# Altium project Arduino Uno R3.PrjPcb (part 1 of 3)
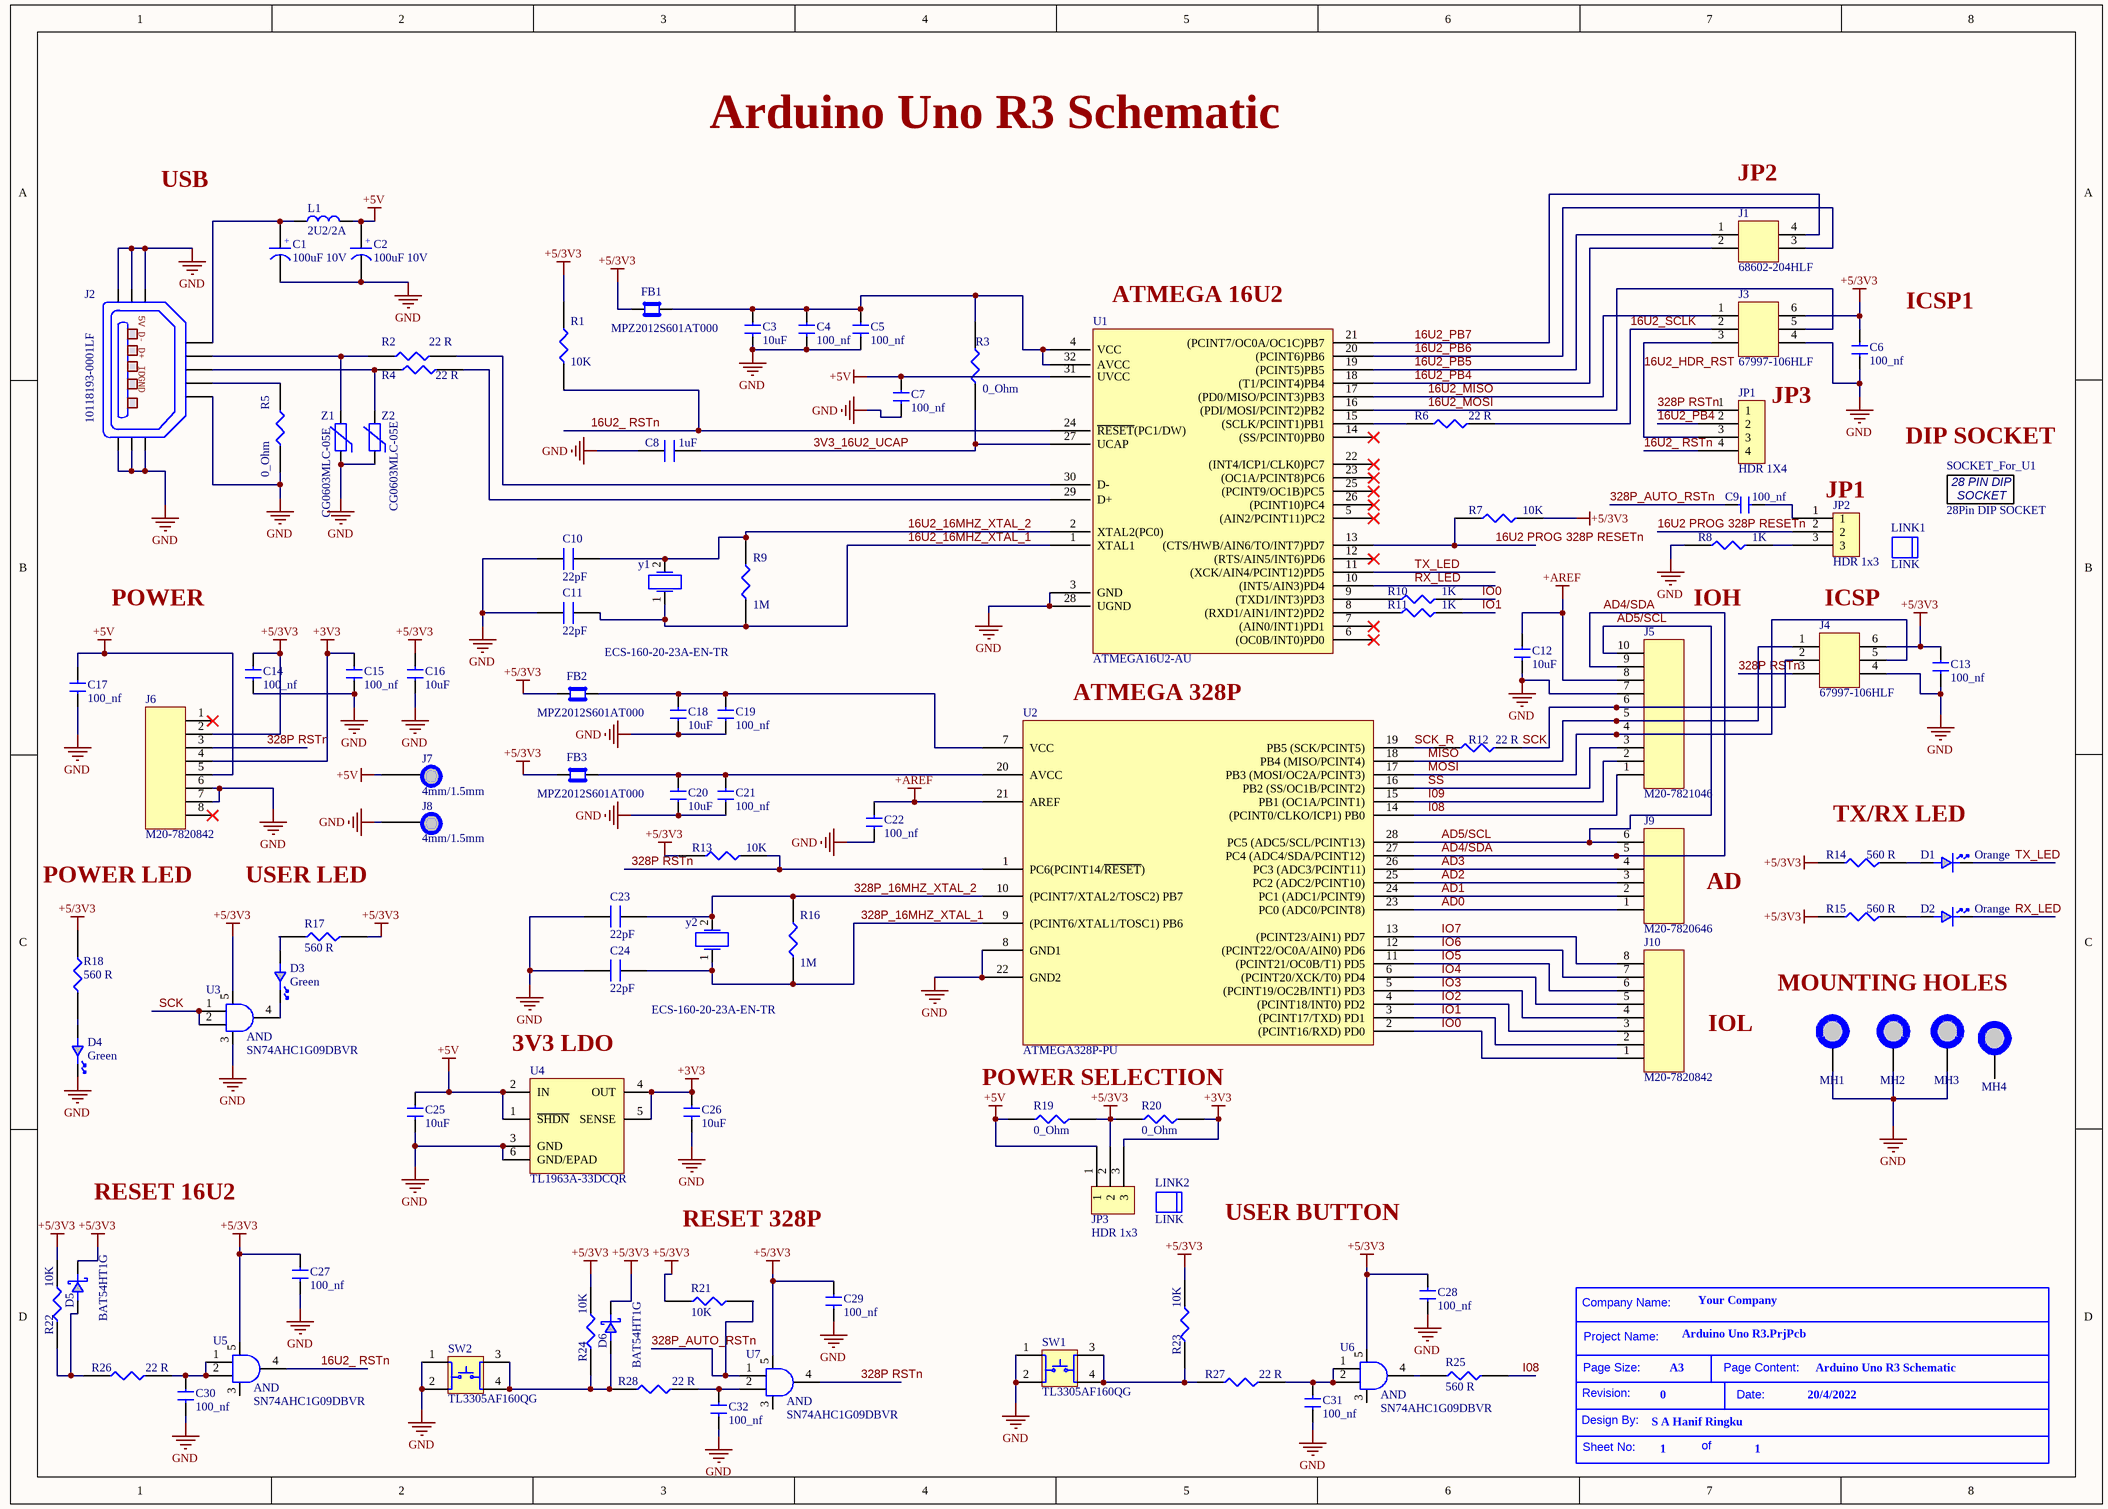
[diagram p0: Schematic Sheet Arduino .SchDoc]
1 sheet, 104 parts. Net scope: global (net labels, ports and power ports of the same name join across sheets).
Board file: PCB Arduino.PcbDoc

## Sheet Schematic Sheet Arduino .SchDoc
size A3; Date: 20/4/2022; CompanyName: Your Company; Engineer: S A Hanif Ringku; Revision: 0; SheetNumber: 1; SheetTotal: 1

### Parts
*  Title_Block  (value not drawn)  (mechanical)
C1  100uF 10V  [Cap_Alu_C_Size]
C2  100uF 10V  [Cap_Alu_C_Size]
C3  10uF  [CAP_0805]
C4  100_nf  [CAP_0805]
C5  100_nf  [CAP_0805]
C6  100_nf  [CAP_0805]
C7  100_nf  [CAP_0805]
C8  1uF  [CAP_0805]
C9  100_nf  [CAP_0805]
C10  22pF  [CAP_0805]
C11  22pF  [CAP_0805]
C12  10uF  [CAP_0805]
C13  100_nf  [CAP_0805]
C14  100_nf  [CAP_0805]
C15  100_nf  [CAP_0805]
C16  10uF  [CAP_0805]
C17  100_nf  [CAP_0805]
C18  10uF  [CAP_0805]
C19  100_nf  [CAP_0805]
C20  10uF  [CAP_0805]
C21  100_nf  [CAP_0805]
C22  100_nf  [CAP_0805]
C23  22pF  [CAP_0805]
C24  22pF  [CAP_0805]
C25  10uF  [CAP_0805]
C26  10uF  [CAP_0805]
C27  100_nf  [CAP_0805]
C28  100_nf  [CAP_0805]
C29  100_nf  [CAP_0805]
C30  100_nf  [CAP_0805]
C31  100_nf  [CAP_0805]
C32  100_nf  [CAP_0805]
D1  Orange  [LED 0603]
D2  Orange  [LED 0603]
D3  Green  [LED 0603]
D4  Green  [LED 0603]
D5  BAT54HT1G  [SOD323]
D6  BAT54HT1G  [SOD323]
FB1  MPZ2012S601AT000  [CAP_0805]
FB2  MPZ2012S601AT000  [CAP_0805]
FB3  MPZ2012S601AT000  [CAP_0805]
J1  68602-204HLF  [Male_HDR_2X2_2.54]
J2  10118193-0001LF  [USB]
J3  67997-106HLF  [MALE_HDR_3X2_2.54mm]
J4  67997-106HLF  [MALE_HDR_3X2_2.54mm]
J5  M20-7821046  [Female_HDR_10\X1_2.54mm_Pitch]
J6  M20-7820842  [Female_HDR_8\X1_2.54mm_Pitch]
J7  4mm/1.5mm  [PAD_WITH_HOLE_4MM/1.5MM]  (no BOM)
J8  4mm/1.5mm  [PAD_WITH_HOLE_4MM/1.5MM]  (no BOM)
J9  M20-7820646  [Female_HDR_6X1_2.54mm_Pitch]
J10  M20-7820842  [Female_HDR_8\X1_2.54mm_Pitch]
JP1  HDR 1X4  [HDR 1X4]
JP2  HDR 1x3  [HDR 1x3]
JP3  HDR 1x3  [HDR 1x3]
L1  2U2/2A  [C1210_Inductor]
LINK1  LINK  (mechanical)
LINK2  LINK  (mechanical)
MH1  MH_7.4_MHC_3.2  [MH_7.4 and 3.2 mm]  (value not drawn)  (no BOM)
MH2  MH_7.4_MHC_3.2  [MH_7.4 and 3.2 mm]  (value not drawn)  (no BOM)
MH3  MH_7.4_MHC_3.2  [MH_7.4 and 3.2 mm]  (value not drawn)  (no BOM)
MH4  Mountain Hole Non Plated  [MH_non_plated]  (value not drawn)  (no BOM)
R1  10K  [R_0805]
R2  22 R  [R_0805]
R3  0_Ohm  [R_0805]
R4  22 R  [R_0805]
R5  0_Ohm  [R_0805]
R6  22 R  [R_0805]
R7  10K  [R_0805]
R8  1K  [R_0805]
R9  1M  [R_0805]
R10  1K  [R_0805]
R11  1K  [R_0805]
R12  22 R  [R_0805]
R13  10K  [R_0805]
R14  560 R  [R_0805]
R15  560 R  [R_0805]
R16  1M  [R_0805]
R17  560 R  [R_0805]
R18  560 R  [R_0805]
R19  0_Ohm  [R_0805]
R20  0_Ohm  [R_0805]
R21  10K  [R_0805]
R22  10K  [R_0805]
R23  10K  [R_0805]
R24  10K  [R_0805]
R25  560 R  [R_0805]
R26  22 R  [R_0805]
R27  22 R  [R_0805]
R28  22 R  [R_0805]
SOCKET_For_U1  28Pin DIP SOCKET  [28 DIP_7.62mm_SOCKET]
SW1  TL3305AF160QG  [SW_PB_SMD]
SW2  TL3305AF160QG  [SW_PB_SMD]
U1  ATMEGA16U2-AU  [TQFP32]
U2  ATMEGA328P-PU  [Atmega_328P]
U3  SN74AHC1G09DBVR  [DBV SOT 23_5]
U4  TL1963A-33DCQR  [DCQR_PDSO_G6]
U5  SN74AHC1G09DBVR  [DBV SOT 23_5]
U6  SN74AHC1G09DBVR  [DBV SOT 23_5]
U7  SN74AHC1G09DBVR  [DBV SOT 23_5]
y1  ECS-160-20-23A-EN-TR  [Xtal_16MHZ]
y2  ECS-160-20-23A-EN-TR  [Xtal_16MHZ]
Z1  CG0603MLC-05E  [R0603]
Z2  CG0603MLC-05E  [R0603]

### Nets
+3V3: C15.2 C26.1 J6.4 JP3.3 R20.2 U4.4(OUT) U4.5(SENSE)
+5/3V3: C6.2 C13.2 C14.2 C16.1 C27.2 C28.2 C29.2 D5.1(Cathode) D6.1(Cathode) FB1.1 FB2.1 FB3.1 J3.6 J4.6 J6.2 JP3.2 R1.2 R7.2 R13.1 R14.1 R15.1 R17.2 R18.2 R19.2 R20.1 R21.1 R22.2 R23.2 R24.2 U3.5 U5.5 U6.5 U7.5
+5V: C2.1 C7.1 C17.2 C25.1 J6.5 J7.1 JP3.1 L1.2 R19.1 U1.31(UVCC) U4.1(~{SHDN}) U4.2(IN)
+AREF: C12.1 C22.2 J5.8 U2.21(AREF)
GND: C1.2 C2.2 C3.2 C4.1 C5.2 C6.1 C7.2 C8.1 C10.1 C11.1 C12.2 C13.1 C14.1 C15.1 C16.2 C17.1 C18.2 C19.1 C20.2 C21.1 C22.1 C23.1 C24.1 C25.2 C26.2 C27.1 C28.1 C29.1 C30.1 C31.1 C32.1 D4.1(Cathode) J2.5 J2.6 J2.7 J2.8 J2.9 J2.10 J2.11 J3.4 J4.4 J5.7 J6.6 J6.7 J8.1 MH1.1 MH2.1 MH3.1 R5.1 R8.1 SW1.1 SW1.2 SW2.1 SW2.2 U1.3(GND) U1.28(UGND) U2.8(GND1) U2.22(GND2) U3.3 U4.3(GND) U4.6(GND/EPAD) Z1.2 Z2.2
3V3_16U2_UCAP: C8.2 R3.1 U1.27(UCAP)
16U2 PROG 328P RESETn: JP2.2 R7.1 U1.13((CTS/HWB/AIN6/TO/INT7)PD7)
16U2_16MHZ_XTAL_1: C11.2 R9.1 U1.1(XTAL1) y1.1
16U2_16MHZ_XTAL_2: C10.2 R9.2 U1.2(XTAL2(PC0)) y1.2
16U2_ RSTn: JP1.4 R1.1 U1.24(~{RESET}(PC1/DW)) U5.4
16U2_HDR_RST: J3.3 JP1.3
16U2_MISO: J3.1 U1.17((PD0/MISO/PCINT3)PB3)
16U2_MOSI: J3.5 U1.16((PDI/MOSI/PCINT2)PB2)
16U2_PB4: J1.2 JP1.2 U1.18((T1/PCINT4)PB4)
16U2_PB5: J1.1 U1.19((PCINT5)PB5)
16U2_PB6: J1.3 U1.20((PCINT6)PB6)
16U2_PB7: J1.4 U1.21((PCINT7/OC0A/OC1C)PB7)
16U2_SCLK: J3.2 R6.2
328P RSTn: J4.3 J6.3 JP1.1 R13.2 U2.1(PC6(PCINT14/~{RESET})) U7.4
328P_16MHZ_XTAL_1: C24.2 R16.1 U2.9((PCINT6/XTAL1/TOSC1)_PB6) y2.1
328P_16MHZ_XTAL_2: C23.2 R16.2 U2.10((PCINT7/XTAL2/TOSC2)_PB7) y2.2
328P_AUTO_RSTn: C9.1 R21.2 U7.1
AD0: J9.1 U2.23(PC0_(ADC0/PCINT8))
AD1: J9.2 U2.24(PC1_(ADC1/PCINT9))
AD2: J9.3 U2.25(PC2_(ADC2/PCINT10))
AD3: J9.4 U2.26(PC3_(ADC3/PCINT11))
AD4/SDA: J5.9 J9.5 U2.27(PC4_(ADC4/SDA/PCINT12))
AD5/SCL: J5.10 J9.6 U2.28(PC5_(ADC5/SCL/PCINT13))
I08: J5.1 R25.2 U2.14((PCINT0/CLKO/ICP1)_PB0)
I09: J5.2 U2.15(PB1_(OC1A/PCINT1))
IO0: J10.1 R10.2 U2.2((PCINT16/RXD)_PD0)
IO1: J10.2 R11.2 U2.3((PCINT17/TXD)_PD1)
IO2: J10.3 U2.4((PCINT18/INT0)_PD2)
IO3: J10.4 U2.5((PCINT19/OC2B/INT1)_PD3)
IO4: J10.5 U2.6((PCINT20/XCK/T0)_PD4)
IO5: J10.6 U2.11((PCINT21/OC0B/T1)_PD5)
IO6: J10.7 U2.12((PCINT22/OC0A/AIN0)_PD6)
IO7: J10.8 U2.13((PCINT23/AIN1)_PD7)
MISO: J4.1 J5.5 U2.18(PB4_(MISO/PCINT4))
MOSI: J4.5 J5.4 U2.17(PB3_(MOSI/OC2A/PCINT3))
RX_LED: D2.1(Cathode) U1.10((INT5/AIN3)PD4)
SCK: J4.2 J5.6 R12.2 U3.1 U3.2
SCK_R: R12.1 U2.19(PB5_(SCK/PCINT5))
SS: J5.3 U2.16(PB2_(SS/OC1B/PCINT2))
TX_LED: D1.1(Cathode) U1.11((XCK/AIN4/PCINT12)PD5)
NetC1_1: C1.1 J2.1 L1.1
NetC3_1: C3.1 C4.2 C5.1 FB1.2 R3.2 U1.4(VCC) U1.32(AVCC)
NetC9_2: C9.2 JP2.1
NetC18_1: C18.1 C19.2 FB2.2 U2.7(VCC)
NetC20_1: C20.1 C21.2 FB3.2 U2.20(AVCC)
NetC30_2: C30.2 R26.2 U5.1 U5.2
NetC31_2: C31.2 R27.2 U6.1 U6.2
NetC32_2: C32.2 R28.2 U7.2
NetD1_2: D1.2(Anode) R14.2
NetD2_2: D2.2(Anode) R15.2
NetD3_1: D3.1(Cathode) U3.4
NetD3_2: D3.2(Anode) R17.1
NetD4_2: D4.2(Anode) R18.1
NetD5_2: D5.2(Anode) R22.1 R26.1
NetD6_2: D6.2(Anode) R24.1 R28.1 SW2.3 SW2.4
NetJ2_2: J2.2 R2.1 Z1.1
NetJ2_3: J2.3 R4.1 Z2.1
NetJ2_4: J2.4 R5.2
NetJP2_3: JP2.3 R8.2
NetR2_2: R2.2 U1.30(D-)
NetR4_2: R4.2 U1.29(D+)
NetR6_1: R6.1 U1.15((SCLK/PCINT1)PB1)
NetR10_1: R10.1 U1.9((TXD1/INT3)PD3)
NetR11_1: R11.1 U1.8((RXD1/AIN1/INT2)PD2)
NetR23_1: R23.1 R27.1 SW1.3 SW1.4
NetR25_1: R25.1 U6.4

Not connected (* = marked no-connect by the designer): J6 1* 8*; MH4 2; U1 5((AIN2/PCINT11)PC2)* 6((OC0B/INT0)PD0)* 7((AIN0/INT1)PD1)* 12((RTS/AIN5/INT6)PD6)* 14((SS/PCINT0)PB0)* 22((INT4/ICP1/CLK0)PC7)* 23((OC1A/PCINT8)PC6)* 25((PCINT9/OC1B)PC5)* 26((PCINT10)PC4)*; U5 3(4); U6 3(4); U7 3(4)

### Notes on the sheet
- Arduino Uno R3 Schematic
- (near J1) JP2
- USB
- (near U1) ATMEGA 16U2
- ICSP1
- JP3
- (near SOCKET_For_U1) DIP SOCKET
- (near JP2) JP1
- POWER
- (near R8) IOH
- ICSP
- ATMEGA 328P
- TX/RX LED
- POWER LED
- USER LED
- AD
- MOUNTING HOLES
- (near U4) 3V3 LDO
- IOL
- POWER SELECTION
- RESET 16U2
- RESET 328P
- USER BUTTON
- A3
- (in symbol 28_PIN_DIP_Socket) 28 PIN DIP; SOCKET
- (in symbol AND_Gate 2input) AND
- (in symbol CAP_POLAR_100uf_10V) +
- (in symbol Micro_USB) 5V; D-; D+; ID; GND
- (in symbol Title_Block) Company Name:; Project Name:; Page Size:; Page Content:; Revision:; Date:; Design By:; Sheet No:; of